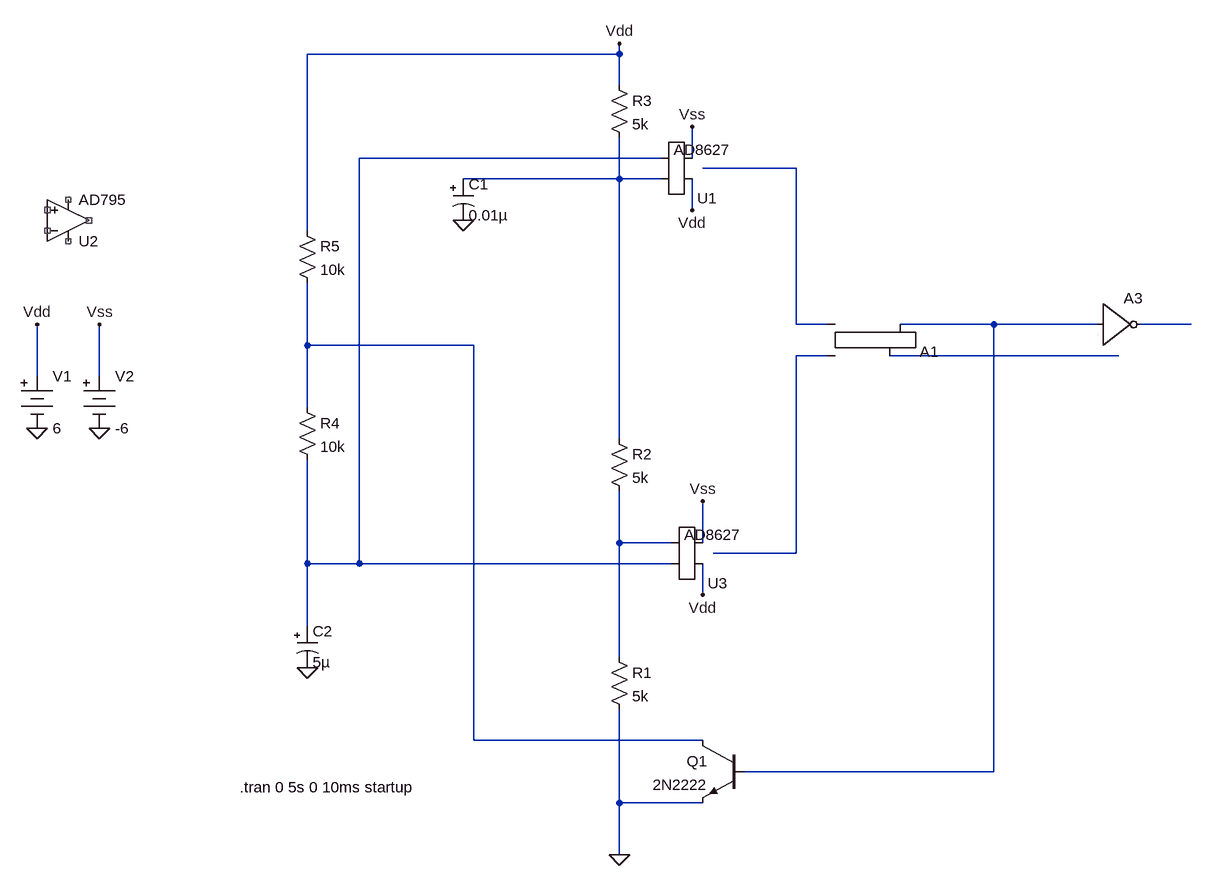
[diagram p0: schematic 555Astable with AD8627.asc]
555Astable with AD8627.asc, the LTspice schematic file:
Version 4
SHEET 1 1300 964
WIRE 16 -288 16 -304
WIRE 16 -288 -464 -288
WIRE 16 -240 16 -288
WIRE 80 -128 -384 -128
WIRE 128 -128 128 -176
WIRE 160 -112 144 -112
WIRE 288 -112 160 -112
WIRE 16 -96 16 -160
WIRE 16 -96 -224 -96
WIRE 80 -96 16 -96
WIRE 128 -48 128 -96
WIRE -464 -16 -464 -288
WIRE 288 128 288 -112
WIRE 336 128 288 128
WIRE 592 128 448 128
WIRE 752 128 592 128
WIRE 896 128 816 128
WIRE -464 160 -464 64
WIRE -208 160 -464 160
WIRE 336 176 288 176
WIRE 784 176 432 176
WIRE -880 208 -880 128
WIRE -784 208 -784 128
WIRE -464 256 -464 160
WIRE 16 304 16 -96
WIRE 16 464 16 384
WIRE 96 464 16 464
WIRE 144 464 144 400
WIRE 176 480 160 480
WIRE 288 480 288 176
WIRE 288 480 176 480
WIRE -464 496 -464 336
WIRE -384 496 -384 -128
WIRE -384 496 -464 496
WIRE 96 496 -384 496
WIRE 144 544 144 496
WIRE -464 592 -464 496
WIRE 16 640 16 464
WIRE -208 768 -208 160
WIRE 144 768 -208 768
WIRE 592 816 592 128
WIRE 592 816 208 816
WIRE 16 864 16 720
WIRE 144 864 16 864
WIRE 16 944 16 864
FLAG 16 944 0
FLAG -224 -32 0
FLAG -464 656 0
FLAG -880 288 0
FLAG -784 288 0
FLAG -880 128 Vdd
FLAG 128 -48 Vdd
FLAG 144 544 Vdd
FLAG -784 128 Vss
FLAG 128 -176 Vss
FLAG 144 400 Vss
FLAG 16 -304 Vdd
DATAFLAG 864 128 ""
DATAFLAG 656 128 ""
DATAFLAG 672 176 ""
DATAFLAG 672 176 ""
DATAFLAG 672 176 ""
DATAFLAG 672 176 ""
SYMBOL res 0 624 R0
SYMATTR InstName R1
SYMATTR Value 5k
SYMBOL res 0 288 R0
SYMATTR InstName R2
SYMATTR Value 5k
SYMBOL res 0 -256 R0
SYMATTR InstName R3
SYMATTR Value 5k
SYMBOL res -480 240 R0
SYMATTR InstName R4
SYMATTR Value 10k
SYMBOL res -480 -32 R0
SYMATTR InstName R5
SYMATTR Value 10k
SYMBOL polcap -240 -96 R0
SYMATTR InstName C1
SYMATTR Value 0.01µ
SYMBOL polcap -480 592 R0
SYMATTR InstName C2
SYMATTR Value 5µ
SYMBOL npn 208 768 M0
SYMATTR InstName Q1
SYMATTR Value 2N2222
SYMBOL Digital\\srflop 384 224 M180
SYMATTR InstName A1
SYMATTR SpiceLine Vhigh=6 Vlow=0 Ref=0.5
SYMBOL Digital\\inv 752 64 R0
SYMATTR InstName A3
SYMATTR SpiceLine Vhigh=6 Vlow=0 Ref=0.5
SYMBOL OpAmps\\AD795 -832 32 M180
SYMATTR InstName U2
SYMBOL AutoGenerated\\AD8627 112 -112 M180
WINDOW 3 31 13 Top 2
SYMATTR InstName U1
SYMBOL AutoGenerated\\AD8627 128 480 M180
WINDOW 3 31 13 Top 2
SYMATTR InstName U3
SYMBOL Misc\\battery -880 192 R0
WINDOW 123 0 0 Left 0
WINDOW 39 0 0 Left 0
SYMATTR InstName V1
SYMATTR Value 6
SYMBOL Misc\\battery -784 192 R0
WINDOW 123 0 0 Left 0
WINDOW 39 0 0 Left 0
SYMATTR InstName V2
SYMATTR Value -6
TEXT -568 840 Left 2 !.tran 0 5s 0 10ms startup

The netlist it stands for:
* 555Astable with AD8627.asc
R1 N009 0 5k
R2 N003 N009 5k
R3 Vdd N003 5k
R4 N006 N001 10k
R5 Vdd N006 10k
C1 N003 0 0.01µ
C2 N001 0 5µ
Q1 N006 N004 0 0 2N2222
A1 N007 N002 0 0 0 N004 N008 0 SRFLOP Vhigh=6 Vlow=0 Ref=0.5
A3 N004 0 0 0 0 N005 0 0 BUF Vhigh=6 Vlow=0 Ref=0.5
XU2 NC_01 NC_02 NC_03 NC_04 NC_05 AD795  ; pins In+ In- V+ V- OUT
* U1: AD8627 (symbol AutoGenerated\AD8627 not available, pins judged from their places): pin1=N003 pin2=N001 pin3=Vdd pin4=Vss
* U3: AD8627 (symbol AutoGenerated\AD8627 not available, pins judged from their places): pin1=N001 pin2=N009 pin3=Vdd pin4=Vss
V1 Vdd 0 6
V2 Vss 0 -6
.model NPN NPN
.model PNP PNP
.lib standard.bjt
.tran 0 5s 0 10ms startup
.lib ADI1.lib
.backanno
.end